# Altium schematic sheet Robin_v0.SchDoc
size A4
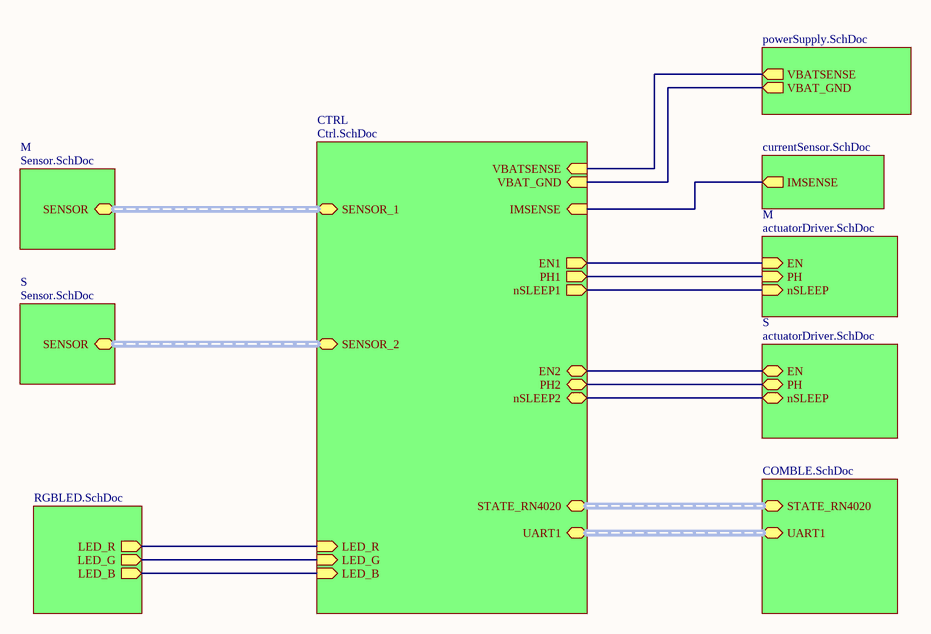
[diagram p0: Robin_v0.SchDoc]

## Sub-sheets
CTRL = Ctrl.SchDoc: STATE_RN4020 (harness STATE_RN4020), VBATSENSE (in), VBAT_GND (in), EN1 (out), PH1 (out), nSLEEP1 (out), EN2, PH2, nSLEEP2, IMSENSE (in), UART1 (harness UART1), SENSOR_1 (harness SENSOR_1), SENSOR_2 (harness SENSOR_2), LED_R (in), LED_B (in), LED_G (in)
M = actuatorDriver.SchDoc: EN (in), PH (in), nSLEEP (in)
M = Sensor.SchDoc: SENSOR (harness SENSOR_1)
S = actuatorDriver.SchDoc: EN, PH, nSLEEP
S = Sensor.SchDoc: SENSOR (harness SENSOR_2)
? = powerSupply.SchDoc: VBATSENSE (out), VBAT_GND (out)
? = COMBLE.SchDoc: STATE_RN4020 (harness STATE_RN4020), UART1 (harness UART1)
? = currentSensor.SchDoc: IMSENSE (out)
? = RGBLED.SchDoc: LED_R (out), LED_G (out), LED_B (out)

## Nets
(unnamed): sheet CTRL/VBATSENSE, sheet /VBATSENSE
(unnamed): sheet CTRL/VBAT_GND, sheet /VBAT_GND
(unnamed): sheet CTRL/EN1, sheet M/EN
(unnamed): sheet CTRL/PH1, sheet M/PH
(unnamed): sheet CTRL/nSLEEP1, sheet M/nSLEEP
(unnamed): sheet CTRL/EN2, sheet S/EN
(unnamed): sheet CTRL/PH2, sheet S/PH
(unnamed): sheet CTRL/nSLEEP2, sheet S/nSLEEP
(unnamed): sheet CTRL/IMSENSE, sheet /IMSENSE
(unnamed): sheet CTRL/LED_R, sheet /LED_R
(unnamed): sheet CTRL/LED_B, sheet /LED_B
(unnamed): sheet CTRL/LED_G, sheet /LED_G

## Buses and harness runs
harness sheet /STATE_RN4020 = sheet CTRL/STATE_RN4020
harness sheet /UART1 = sheet CTRL/UART1
harness sheet CTRL/SENSOR_1 = sheet M/SENSOR
harness sheet CTRL/SENSOR_2 = sheet S/SENSOR